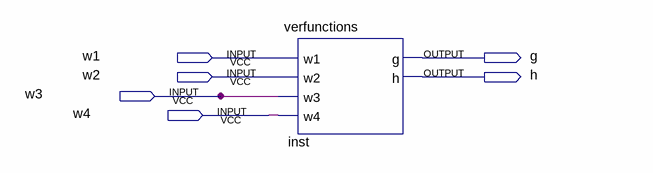
[diagram p0: schematic sheet]
// Quartus schematic Block3.bdf as structural Verilog: 1 symbols, 6 pins
module Block3 (
  input  w1,
  input  w2,
  input  w3,
  input  w4,
  output g,
  output h
);

  verfunctions inst (.w1(w1), .w2(w2), .w3(w3), .w4(w4), .g(g), .h(h));
endmodule
